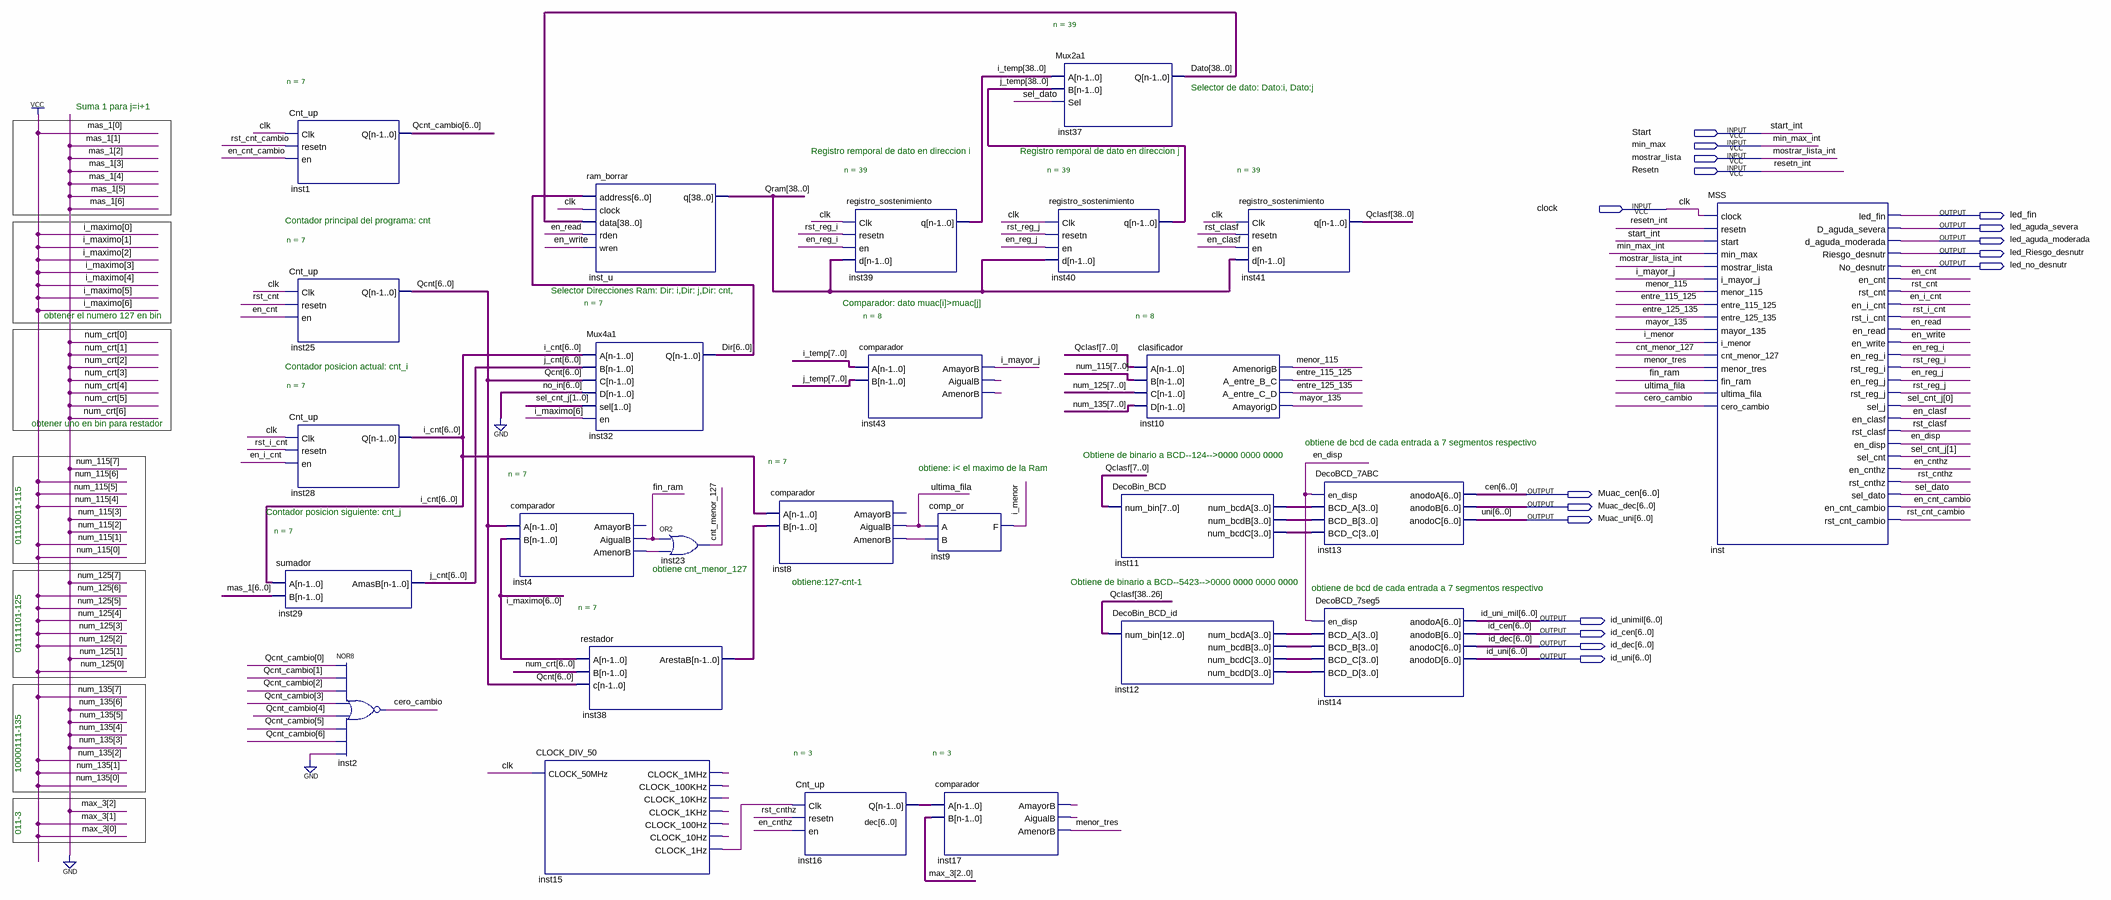
[diagram p0: schematic sheet]
// Quartus schematic sistema_ordenador.bdf as structural Verilog: 26 symbols, 17 pins
module sistema_ordenador (
  input  Start,
  input  min_max,
  input  mostrar_lista,
  input  Resetn,
  input  clock,
  output led_fin,
  output led_aguda_severa,
  output led_aguda_moderada,
  output led_Riesgo_desnutr,
  output led_no_desnutr,
  output [6:0] Muac_cen,
  output [6:0] Muac_dec,
  output [6:0] Muac_uni,
  output [6:0] id_unimil,
  output [6:0] id_cen,
  output [6:0] id_dec,
  output [6:0] id_uni
);

  wire cero_cambio, cnt_menor_127, en_clasf, en_cnt, en_cnt_cambio, en_cnthz, en_disp, en_i_cnt, en_read,
       en_reg_i, en_reg_j, en_write, entre_115_125, entre_125_135, fin_ram, i_mayor_j, i_menor,
       inst4_amenorb, inst8_amenorb, inst15_clock_1hz, inst15_clock_1khz, inst15_clock_1mhz,
       inst15_clock_10hz, inst15_clock_10khz, inst15_clock_100hz, inst15_clock_100khz, inst17_aigualb,
       inst17_amayorb, inst43_aigualb, inst43_amenorb, mayor_135, menor_115, menor_tres, rst_clasf, rst_cnt,
       rst_cnt_cambio, rst_cnthz, rst_i_cnt, rst_reg_i, rst_reg_j, sel_dato, ultima_fila;
  wire [1:0] sel_cnt_j;
  wire [2:0] inst16_q;
  wire [3:0] inst11_num_bcda, inst11_num_bcdb, inst11_num_bcdc, inst12_num_bcda, inst12_num_bcdb,
       inst12_num_bcdc, inst12_num_bcdd;
  wire [6:0] Dir, i_cnt, inst38_arestab, j_cnt, Qcnt, Qcnt_cambio;
  wire [38:0] Dato, i_temp, j_temp, Qclasf, Qram;

  sumador #(.n(7)) inst29 (.A(i_cnt), .B(7'b0000001), .AmasB(j_cnt));
  Cnt_up #(.n(7)) inst1 (.Clk(clock), .resetn(rst_cnt_cambio), .en(en_cnt_cambio), .Q(Qcnt_cambio));
  Cnt_up #(.n(7)) inst25 (.Clk(clock), .resetn(rst_cnt), .en(en_cnt), .Q(Qcnt));
  Cnt_up #(.n(7)) inst28 (.Clk(clock), .resetn(rst_i_cnt), .en(en_i_cnt), .Q(i_cnt));
  nor inst2 (cero_cambio, Qcnt_cambio[0], Qcnt_cambio[1], Qcnt_cambio[2], Qcnt_cambio[3], Qcnt_cambio[4], Qcnt_cambio[5], Qcnt_cambio[6], 1'b0);
  comparador #(.n(7)) inst4 (.A(Qcnt), .B({7{1'b1}}), .AigualB(fin_ram), .AmenorB(inst4_amenorb));  // open: AmayorB
  CLOCK_DIV_50 inst15 (
    .CLOCK_50MHz(clock), .CLOCK_1MHz(inst15_clock_1mhz), .CLOCK_100KHz(inst15_clock_100khz),
    .CLOCK_10KHz(inst15_clock_10khz), .CLOCK_1KHz(inst15_clock_1khz), .CLOCK_100Hz(inst15_clock_100hz),
    .CLOCK_10Hz(inst15_clock_10hz), .CLOCK_1Hz(inst15_clock_1hz));
  ram_borrar inst_u (.address(Dir), .clock(clock), .data(Dato), .rden(en_read), .wren(en_write), .q(Qram));
  Mux4a1 #(.n(7)) inst32 (.A(i_cnt), .B(j_cnt), .C(Qcnt), .D({7{1'b0}}), .sel(sel_cnt_j), .en(1'b1), .Q(Dir));
  restador #(.n(7)) inst38 (.A({7{1'b1}}), .B({7{1'b0}}), .c(Qcnt), .ArestaB(inst38_arestab));
  or inst23 (cnt_menor_127, fin_ram, inst4_amenorb);
  comparador #(.n(7)) inst8 (
    .A(i_cnt), .B(inst38_arestab), .AigualB(ultima_fila), .AmenorB(inst8_amenorb));  // open: AmayorB
  Cnt_up #(.n(3)) inst16 (.Clk(inst15_clock_1hz), .resetn(rst_cnthz), .en(en_cnthz), .Q(inst16_q));
  registro_sostenimiento #(.n(39)) inst39 (.Clk(clock), .resetn(rst_reg_i), .en(en_reg_i), .d(Qram), .q(i_temp));
  comparador #(.n(8)) inst43 (
    .A(i_temp[7:0]), .B(j_temp[7:0]), .AmayorB(i_mayor_j), .AigualB(inst43_aigualb), .AmenorB(inst43_amenorb));
  comp_or inst9 (.A(ultima_fila), .B(inst8_amenorb), .F(i_menor));
  comparador #(.n(3)) inst17 (
    .A(inst16_q), .B(3'b011), .AmayorB(inst17_amayorb), .AigualB(inst17_aigualb), .AmenorB(menor_tres));
  Mux2a1 #(.n(39)) inst37 (.A(i_temp), .B(j_temp), .Sel(sel_dato), .Q(Dato));
  registro_sostenimiento #(.n(39)) inst40 (.Clk(clock), .resetn(rst_reg_j), .en(en_reg_j), .d(Qram), .q(j_temp));
  clasificador #(.n(8)) inst10 (
    .A(Qclasf[7:0]), .B(8'b01110011), .C(8'b01111101), .D(8'b10000111), .AmenorigB(menor_115),
    .A_entre_B_C(entre_115_125), .A_entre_C_D(entre_125_135), .AmayorigD(mayor_135));
  DecoBin_BCD inst11 (
    .num_bin(Qclasf[7:0]), .num_bcdA(inst11_num_bcda), .num_bcdB(inst11_num_bcdb), .num_bcdC(inst11_num_bcdc));
  DecoBin_BCD_id inst12 (
    .num_bin(Qclasf[38:26]), .num_bcdA(inst12_num_bcda), .num_bcdB(inst12_num_bcdb),
    .num_bcdC(inst12_num_bcdc), .num_bcdD(inst12_num_bcdd));
  registro_sostenimiento #(.n(39)) inst41 (.Clk(clock), .resetn(rst_clasf), .en(en_clasf), .d(Qram), .q(Qclasf));
  DecoBCD_7ABC inst13 (
    .en_disp(en_disp), .BCD_A(inst11_num_bcda), .BCD_B(inst11_num_bcdb), .BCD_C(inst11_num_bcdc),
    .anodoA(Muac_cen), .anodoB(Muac_dec), .anodoC(Muac_uni));
  DecoBCD_7seg5 inst14 (
    .en_disp(en_disp), .BCD_A(inst12_num_bcda), .BCD_B(inst12_num_bcdb), .BCD_C(inst12_num_bcdc),
    .BCD_D(inst12_num_bcdd), .anodoA(id_unimil), .anodoB(id_cen), .anodoC(id_dec), .anodoD(id_uni));
  MSS inst (
    .clock(clock), .resetn(Resetn), .start(Start), .min_max(min_max), .mostrar_lista(mostrar_lista),
    .i_mayor_j(i_mayor_j), .menor_115(menor_115), .entre_115_125(entre_115_125),
    .entre_125_135(entre_125_135), .mayor_135(mayor_135), .i_menor(i_menor), .cnt_menor_127(cnt_menor_127),
    .menor_tres(menor_tres), .fin_ram(fin_ram), .ultima_fila(ultima_fila), .cero_cambio(cero_cambio),
    .led_fin(led_fin), .D_aguda_severa(led_aguda_severa), .d_aguda_moderada(led_aguda_moderada),
    .Riesgo_desnutr(led_Riesgo_desnutr), .No_desnutr(led_no_desnutr), .en_cnt(en_cnt), .rst_cnt(rst_cnt),
    .en_i_cnt(en_i_cnt), .rst_i_cnt(rst_i_cnt), .en_read(en_read), .en_write(en_write), .en_reg_i(en_reg_i),
    .rst_reg_i(rst_reg_i), .en_reg_j(en_reg_j), .rst_reg_j(rst_reg_j), .sel_j(sel_cnt_j[0]),
    .en_clasf(en_clasf), .rst_clasf(rst_clasf), .en_disp(en_disp), .sel_cnt(sel_cnt_j[1]),
    .en_cnthz(en_cnthz), .rst_cnthz(rst_cnthz), .sel_dato(sel_dato), .en_cnt_cambio(en_cnt_cambio),
    .rst_cnt_cambio(rst_cnt_cambio));

  // Other names for the same wires on the sheet: cen[6:0] = Muac_cen; clk = clock; dec[6:0] = Muac_dec;
  //   id_uni_mil[6:0] = id_unimil; min_max_int = min_max; mostrar_lista_int = mostrar_lista; resetn_int = Resetn;
  //   start_int = Start; uni[6:0] = Muac_uni

  // Notes on the sheet:
  //   Selector de dato: Dato:i, Dato:j
  //   Suma 1 para j=i+1
  //   Registro remporal de dato en direccion i
  //   Registro remporal de dato en direccion j
  //   Contador principal del programa: cnt
  //   Selector Direcciones Ram: Dir: i,Dir: j,Dir: cnt,
  //   Comparador: dato muac[i]>muac[j]
  //   obtener el numero 127 en bin
  //   Contador posicion actual: cnt_i
  //   obtener uno en bin para restador
  //   obtiene de bcd de cada entrada a 7 segmentos respectivo 
  //   Obtiene de binario a BCD--124-->0000 0000 0000
  //   obtiene: i< el maximo de la Ram
  //   01110011-115
  //   Contador posicion siguiente: cnt_j
  //   obtiene cnt_menor_127
  //   obtiene:127-cnt-1
  //   Obtiene de binario a BCD--5423-->0000 0000 0000 0000
  //   01111101-125
  //   obtiene de bcd de cada entrada a 7 segmentos respectivo 
  //   10000111-135
  //   011-3
endmodule
